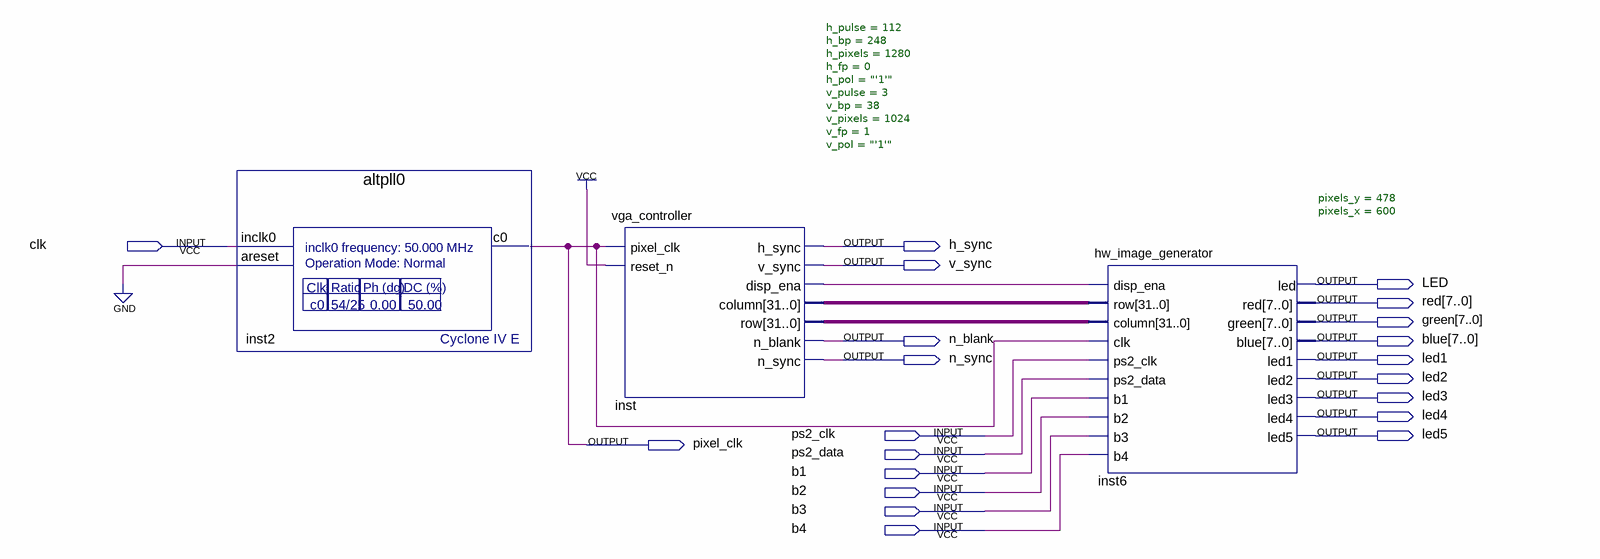
[diagram p0: schematic sheet]
// Quartus schematic vga_with_hw_test_image.bdf as structural Verilog: 3 symbols, 21 pins
module vga_with_hw_test_image (
  input  clk,
  input  ps2_clk,
  input  ps2_data,
  input  b1,
  input  b2,
  input  b3,
  input  b4,
  output h_sync,
  output v_sync,
  output LED,
  output [7:0] red,
  output [7:0] green,
  output n_blank,
  output [7:0] blue,
  output n_sync,
  output led1,
  output led2,
  output led3,
  output led4,
  output led5,
  output pixel_clk
);

  wire inst_disp_ena;
  wire [31:0] inst_column, inst_row;

  altpll0 inst2 (.inclk0(clk), .areset(1'b0), .c0(pixel_clk));
  vga_controller #(.h_pulse(112), .h_bp(248), .h_pixels(1280), .h_fp(0), .h_pol("'1'"), .v_pulse(3), .v_bp(38), .v_pixels(1024), .v_fp(1), .v_pol("'1'")) inst (
    .pixel_clk(pixel_clk), .reset_n(1'b1), .h_sync(h_sync), .v_sync(v_sync), .disp_ena(inst_disp_ena),
    .column(inst_column), .row(inst_row), .n_blank(n_blank), .n_sync(n_sync));
  hw_image_generator #(.pixels_y(478), .pixels_x(600)) inst6 (
    .disp_ena(inst_disp_ena), .row(inst_column), .column(inst_row), .clk(pixel_clk), .ps2_clk(ps2_clk),
    .ps2_data(ps2_data), .b1(b1), .b2(b2), .b3(b3), .b4(b4), .led(LED), .red(red), .green(green),
    .blue(blue), .led1(led1), .led2(led2), .led3(led3), .led4(led4), .led5(led5));
endmodule
